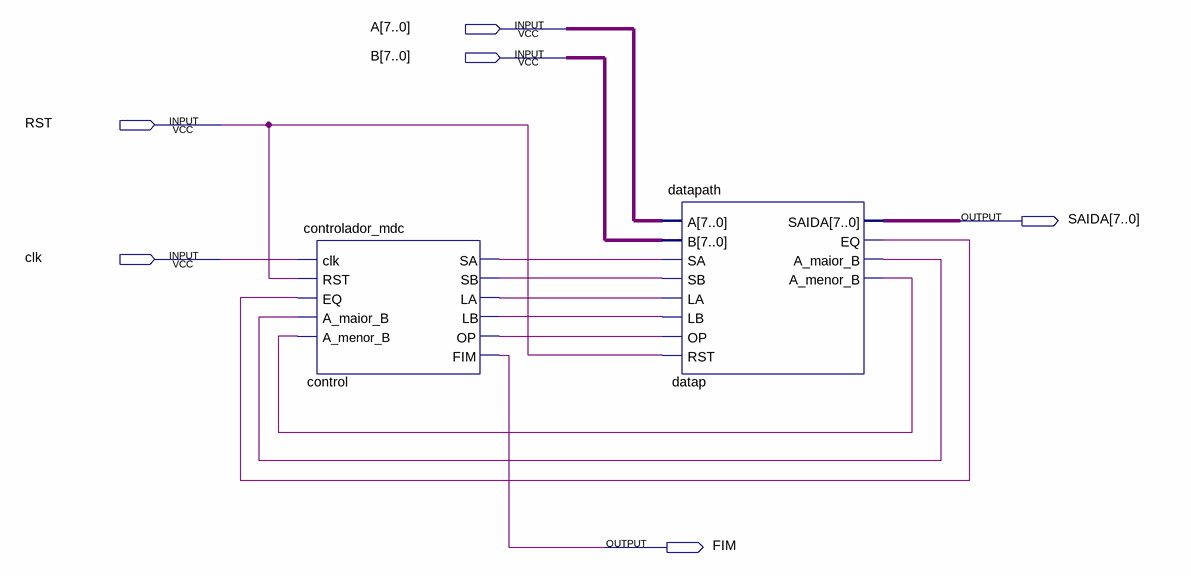
[diagram p0: schematic sheet]
// Quartus schematic GCD.bdf as structural Verilog: 2 symbols, 6 pins
module GCD (
  input  [7:0] A,
  input  [7:0] B,
  input  RST,
  input  clk,
  output [7:0] SAIDA,
  output FIM
);

  wire control_la, control_lb, control_op, control_sa, control_sb, datap_a_maior_b, datap_a_menor_b, datap_eq;

  controlador_mdc control (
    .clk(clk), .RST(RST), .EQ(datap_eq), .A_maior_B(datap_a_maior_b), .A_menor_B(datap_a_menor_b),
    .SA(control_sa), .SB(control_sb), .LA(control_la), .LB(control_lb), .OP(control_op), .FIM(FIM));
  datapath datap (
    .A(A), .B(B), .SA(control_sa), .SB(control_sb), .LA(control_la), .LB(control_lb), .OP(control_op),
    .RST(RST), .SAIDA(SAIDA), .EQ(datap_eq), .A_maior_B(datap_a_maior_b), .A_menor_B(datap_a_menor_b));
endmodule
